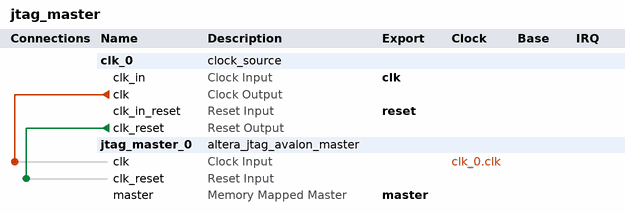
[diagram p0: system contents]
# Platform Designer (Qsys) system jtag_master, MAX 10 10M50DAF484C7G
# Parameters at their usual value, and those the tool derives, are not listed.
package require -exact qsys 25.1
create_system jtag_master
set_project_property DEVICE_FAMILY {MAX 10}
set_project_property DEVICE 10M50DAF484C7G

add_instance clk_0 clock_source 25.1
set_instance_parameter_value clk_0 clockFrequency 25000000
set_instance_parameter_value clk_0 resetSynchronousEdges DEASSERT

add_instance jtag_master_0 altera_jtag_avalon_master 25.1

# connections
add_connection clk_0.clk jtag_master_0.clk clock
add_connection clk_0.clk_reset jtag_master_0.clk_reset reset

# exported interfaces
add_interface clk clock sink
set_interface_property clk EXPORT_OF clk_0.clk_in
add_interface master avalon master
set_interface_property master EXPORT_OF jtag_master_0.master
add_interface reset reset sink
set_interface_property reset EXPORT_OF clk_0.clk_in_reset

set_interconnect_requirement {$system} qsys_mm.clockCrossingAdapter HANDSHAKE
set_interconnect_requirement {$system} qsys_mm.enableEccProtection FALSE
set_interconnect_requirement {$system} qsys_mm.insertDefaultSlave FALSE
set_interconnect_requirement {$system} qsys_mm.maxAdditionalLatency 1

save_system jtag_master.qsys
